# EAGLE design Intsy_128ch_20190417 (EAGLE 9.4.0)
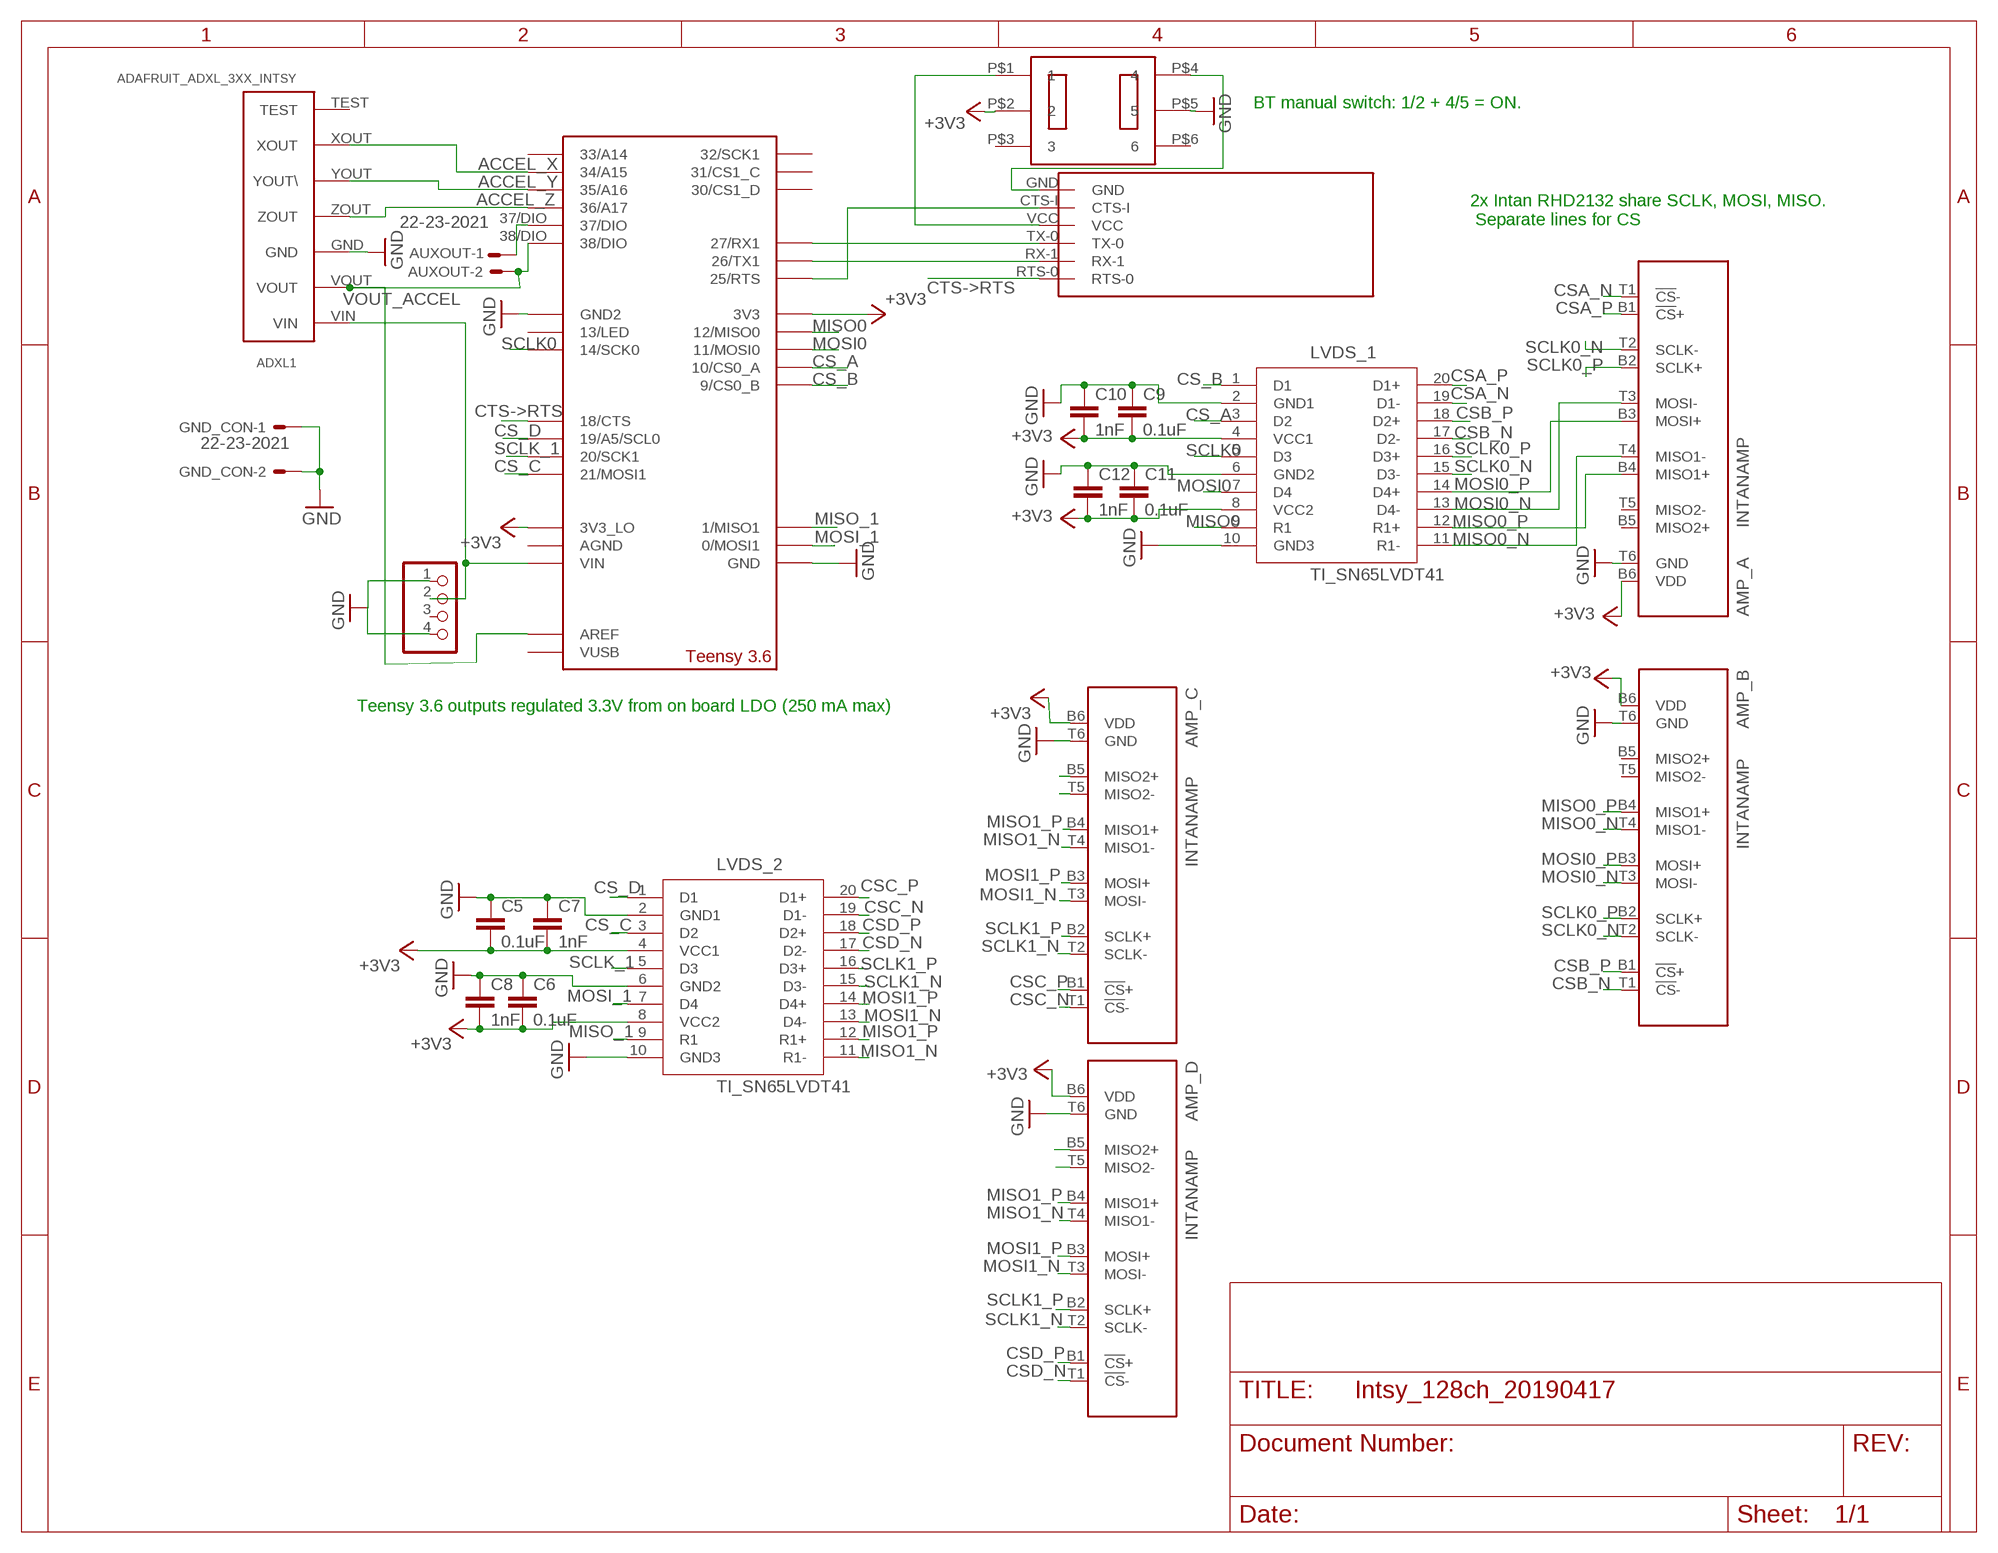
[diagram p0: schematic, sheet 1]

## Parts
ADXL1  ADAFRUIT_ADXL_3XX_INTSY  [ADAFRUIT_ADXL_3XX]
AMP_A  INTANAMP  [AMPBOARD]
AMP_B  INTANAMP  [AMPBOARD]
AMP_C  INTANAMP  [AMPBOARD]
AMP_D  INTANAMP  [AMPBOARD]
AUXOUT  22-23-2021  [22-23-2021]
C5  0.1uF  CC2012  [C2012]
C6  0.1uF  CC2012  [C2012]
C7  1nF  CC2012  [C2012]
C8  1nF  CC2012  [C2012]
C9  0.1uF  CC2012  [C2012]
C10  1nF  CC2012  [C2012]
C11  0.1uF  CC2012  [C2012]
C12  1nF  CC2012  [C2012]
DPDT_1  DPDT_1  SLIDE_SWITCH_DPDT_NIDEC  [SLIDE_SWITCH_DPDT_NIDEC]
GND_CON  22-23-2021  [22-23-2021]
LVDS_1  TI_SN65LVDT41  [SN65LVDT41_TSSOP20]
LVDS_2  TI_SN65LVDT41  [SN65LVDT41_TSSOP20]
RN42  RN42  [RN42]
SW1  LiPoIn  PADS-4  [PADS-4]
U$2  TEENSY_3.5/3.6_SIMPLE  [TEENSY_3.5/3.6_SIMPLE]

## Nets
+3V3: AMP_A.B6(VDD) AMP_B.B6(VDD) AMP_C.B6(VDD) AMP_D.B6(VDD) C5.2 C6.2 C7.2 C8.2 C9.2 C10.2 C11.2 C12.2 DPDT_1.P$2 LVDS_1.4(VCC1) LVDS_1.8(VCC2) LVDS_2.4(VCC1) LVDS_2.8(VCC2) U$2.3V3 U$2.3V3_LO
ACCEL_X: ADXL1.XOUT U$2.34/A15
ACCEL_Y: ADXL1.YOUT(YOUT\) U$2.35/A16
ACCEL_Z: ADXL1.ZOUT U$2.36/A17
CS_A: LVDS_1.3(D2) U$2.10/CS(10/CS0_A)
CS_B: LVDS_1.1(D1) U$2.9/CS(9/CS0_B)
CS_C: LVDS_2.3(D2) U$2.21/CS0/MOSI1(21/MOSI1)
CS_D: LVDS_2.1(D1) U$2.19/A5/SCL(19/A5/SCL0)
CSA_N: AMP_A.T1(!CS!-) LVDS_1.19(D1-)
CSA_P: AMP_A.B1(!CS!+) LVDS_1.20(D1+)
CSB_N: AMP_B.T1(!CS!-) LVDS_1.17(D2-)
CSB_P: AMP_B.B1(!CS!+) LVDS_1.18(D2+)
CSC_N: AMP_C.T1(!CS!-) LVDS_2.19(D1-)
CSC_P: AMP_C.B1(!CS!+) LVDS_2.20(D1+)
CSD_N: AMP_D.T1(!CS!-) LVDS_2.17(D2-)
CSD_P: AMP_D.B1(!CS!+) LVDS_2.18(D2+)
CTS->RTS: RN42.RTS-0 U$2.18/CTS
GND: ADXL1.GND AMP_A.T6(GND) AMP_B.T6(GND) AMP_C.T6(GND) AMP_D.T6(GND) C5.1 C6.1 C7.1 C8.1 C9.1 C10.1 C11.1 C12.1 DPDT_1.P$5 GND_CON.1 GND_CON.2 LVDS_1.2(GND1) LVDS_1.6(GND2) LVDS_1.10(GND3) LVDS_2.2(GND1) LVDS_2.6(GND2) LVDS_2.10(GND3) SW1.1 SW1.4 U$2.GND U$2.GND2
MISO0: LVDS_1.9(R1) U$2.12/MISO0
MISO0_N: AMP_A.T4(MISO1-) AMP_B.T4(MISO1-) LVDS_1.11(R1-)
MISO0_P: AMP_A.B4(MISO1+) AMP_B.B4(MISO1+) LVDS_1.12(R1+)
MISO1_N: AMP_C.T4(MISO1-) AMP_D.T4(MISO1-) LVDS_2.11(R1-)
MISO1_P: AMP_C.B4(MISO1+) AMP_D.B4(MISO1+) LVDS_2.12(R1+)
MISO_1: LVDS_2.9(R1) U$2.1/MISO1
MOSI0: LVDS_1.7(D4) U$2.11/MOSI0
MOSI0_N: AMP_A.T3(MOSI-) AMP_B.T3(MOSI-) LVDS_1.13(D4-)
MOSI0_P: AMP_A.B3(MOSI+) AMP_B.B3(MOSI+) LVDS_1.14(D4+)
MOSI1_N: AMP_C.T3(MOSI-) AMP_D.T3(MOSI-) LVDS_2.13(D4-)
MOSI1_P: AMP_C.B3(MOSI+) AMP_D.B3(MOSI+) LVDS_2.14(D4+)
MOSI_1: LVDS_2.7(D4) U$2.0/MOSI1
N$1: ADXL1.VIN SW1.2 U$2.VIN
N$2: AMP_C.B5(MISO2+)
N$3: AUXOUT.1 U$2.37/DIO
N$4: DPDT_1.P$4 RN42.GND
N$5: RN42.TX-0 U$2.27/RX1
N$6: RN42.RX-1 U$2.26/TX1
N$7: RN42.CTS-I U$2.25/RTS
N$8: AMP_C.T5(MISO2-)
N$9: DPDT_1.P$1 RN42.VCC
N$17: AMP_D.B5(MISO2+)
N$18: AMP_D.T5(MISO2-)
SCLK0: LVDS_1.5(D3) U$2.14/SCK0
SCLK0_N: AMP_A.T2(SCLK-) AMP_B.T2(SCLK-) LVDS_1.15(D3-)
SCLK0_P: AMP_A.B2(SCLK+) AMP_B.B2(SCLK+) LVDS_1.16(D3+)
SCLK1_N: AMP_C.T2(SCLK-) AMP_D.T2(SCLK-) LVDS_2.15(D3-)
SCLK1_P: AMP_C.B2(SCLK+) AMP_D.B2(SCLK+) LVDS_2.16(D3+)
SCLK_1: LVDS_2.5(D3) U$2.20/CS0/SCK1(20/SCK1)
VOUT_ACCEL: ADXL1.VOUT AUXOUT.2 U$2.38/DIO U$2.AREF
Unconnected: ADXL1.TEST AMP_A.B5(MISO2+) AMP_A.T5(MISO2-) AMP_B.B5(MISO2+) AMP_B.T5(MISO2-) DPDT_1.P$3 DPDT_1.P$6 SW1.3 U$2.13/LED/SCK0(13/LED) U$2.30/CS1(30/CS1_D) U$2.31/CS1(31/CS1_C) U$2.32/SCK1 U$2.33/A14 U$2.AGND U$2.VUSB

## Notes on the sheet
- BT manual switch: 1/2 + 4/5 = ON.
- 2x Intan RHD2132 share SCLK, MOSI, MISO.
   Separate lines for CS
- Teensy 3.6 outputs regulated 3.3V from on board LDO (250 mA max)

## Library data of the parts
ADXL1 = adafruit_ADXL3xx_Intsy:ADAFRUIT_ADXL_3XX_INTSY: Bare bones 0.1" header row connector to plug in adafruit ADXL3xx module into a larger system (Intsy), for example, product 1018: https://www.adafruit.com/product/1018
AMP_A AMP_B AMP_C AMP_D = INTANAMP:INTANAMP
AUXOUT GND_CON = con-molex:22-23-2021: .100" (2.54mm) Center Header - 2 Pin; MF: MOLEX; MPN: 22-23-2021; OC_FARNELL: 1462926; OC_NEWARK: 25C3832
C5-C12 = eagle-ltspice:C: CAPACITOR, European symbol; SPICEMODEL: NONE; SPICEPREFIX: C
DPDT_1 = Teensy356:SLIDE_SWITCH_DPDT_NIDEC
LVDS_1 LVDS_2 = TI_SN65LVDT41:TI_SN65LVDT41: TI SN65LVDT41 LVDS-CMOS converter with 4 drivers + 1 receiver. Based on datasheet: http://www.ti.com/lit/ds/symlink/sn65lvdt14-ep.pdf
RN42 = BLUETOOTH_MODULES:RN42
SW1 = breakouts:PADS-4: PIN HEADER
U$2 = Teensy356:TEENSY_3.5/3.6_SIMPLE: Teensy 3.6 for Intsy 128 chan module (SPI0 and SPI1) + Bluetooth Coms (RX/TX + CTS/RTS) + Analog accelerometer (ax, ay, az) + digital I/O + power. Only pins used in the module are retained in this device; the rest are removed to allow for easier/uncluttered wiring. -Jon Erickson, 07 May 2019

## Board
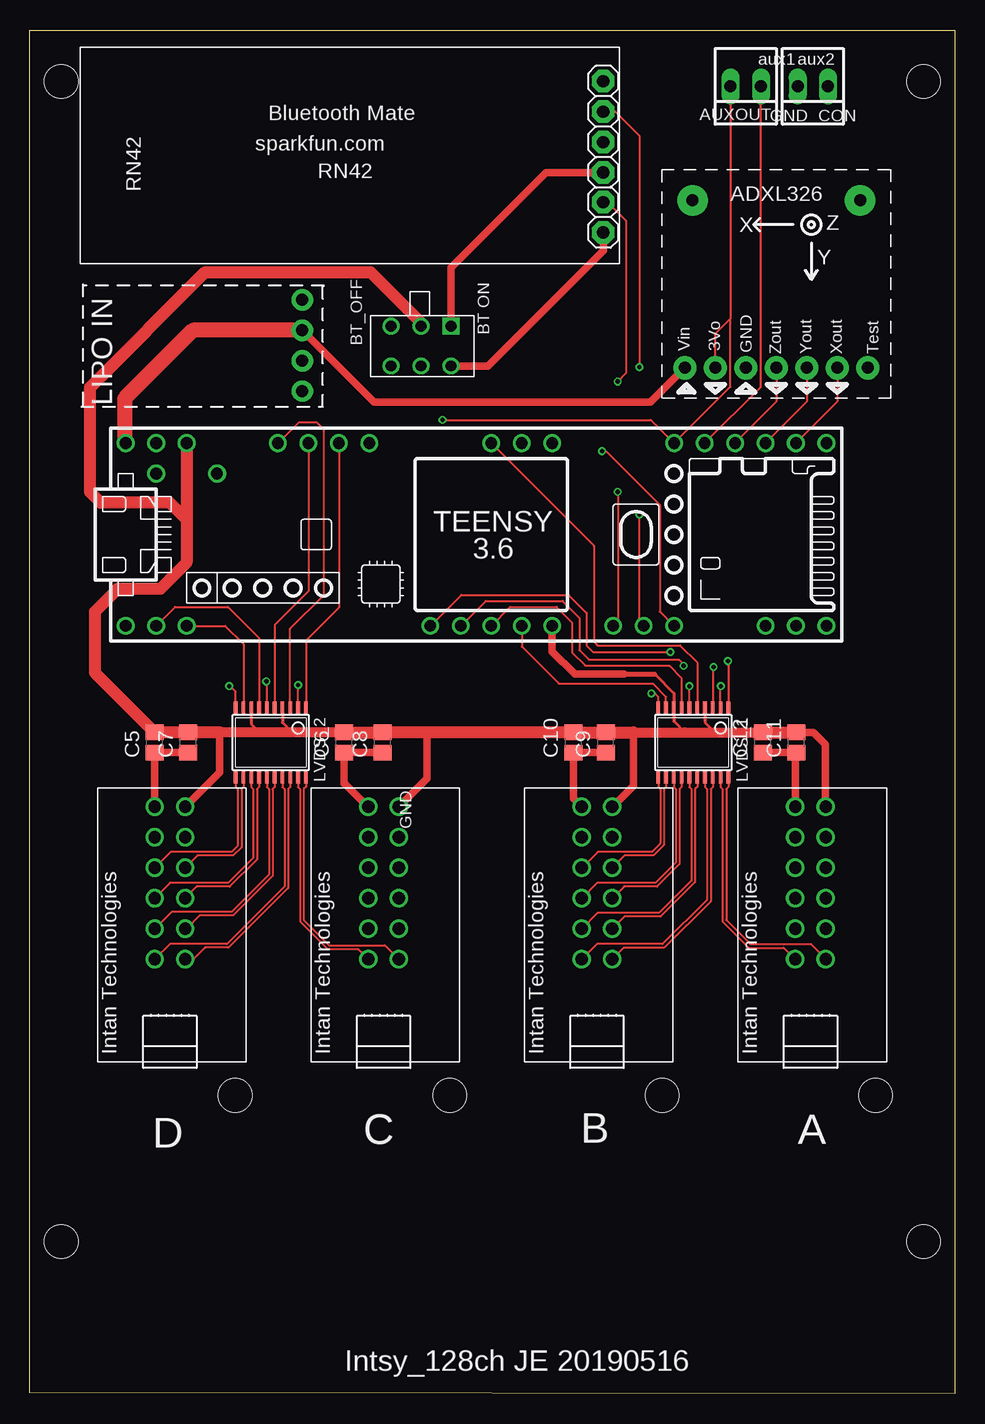
[diagram p1: board, top side]
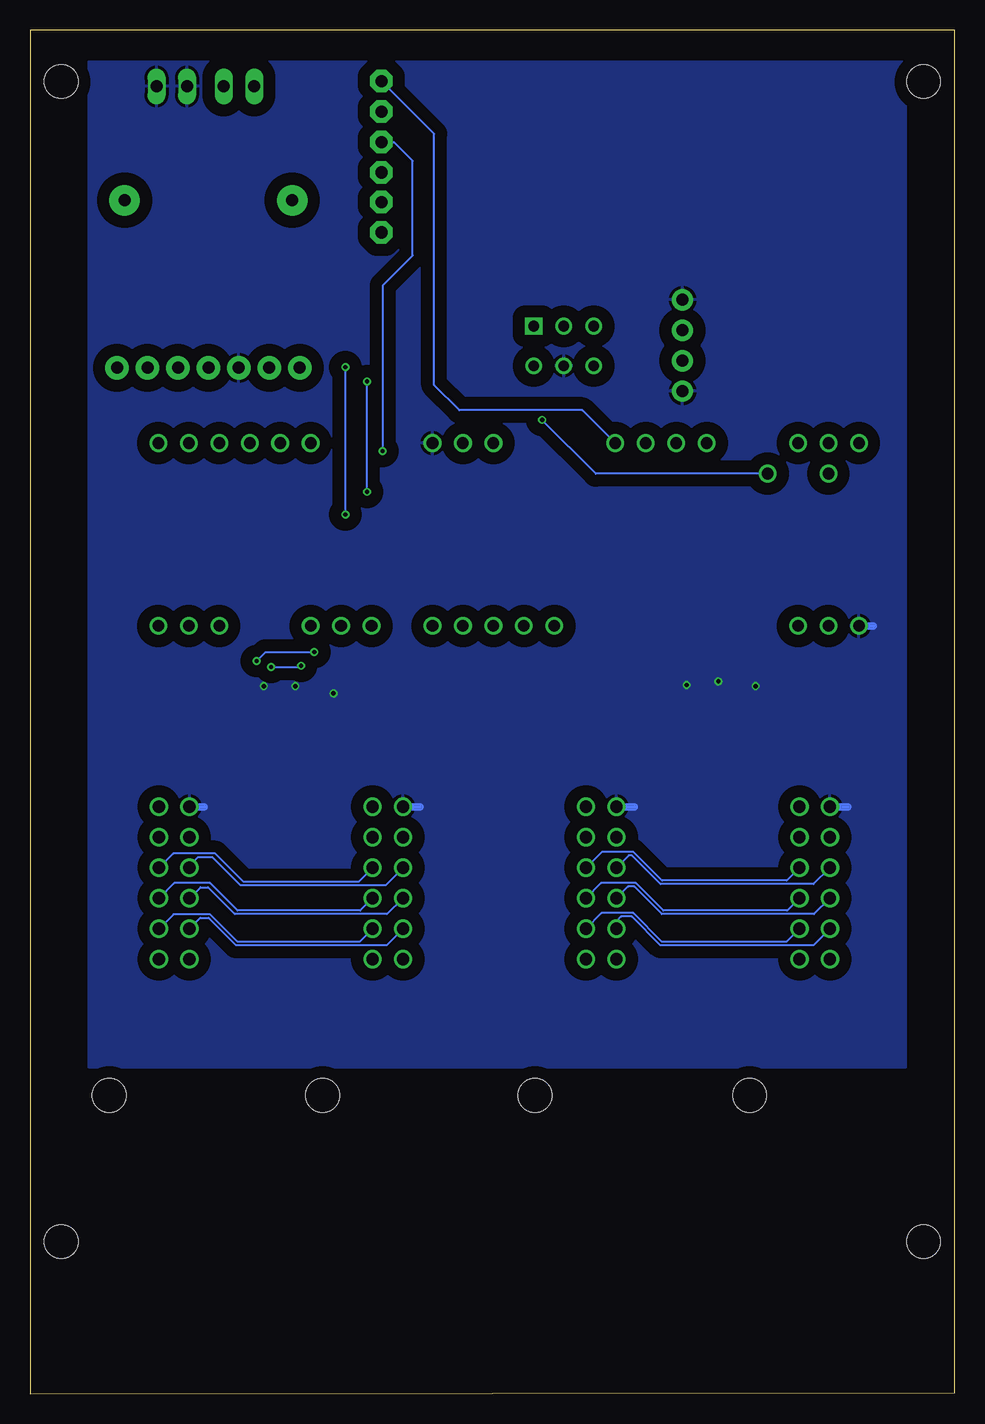
[diagram p2: board, bottom side, seen from below]

Size 77.1 x 113.69 mm. Coordinates in mm from the lower left corner, seen from the top.
Outline: 0,0.1 0,113.69 77.1,113.69 77.1,0 0,0.1
Copper layers (1*16): Top 0.035mm / dielectric 1.5mm / Bottom 0.035mm
Design rules "SeeedStudio_2layer_DRU_no_angle_20140221": minimum track width 6mil, minimum drill 12mil, track to track 6mil, track to pad 6mil, pad to pad 6mil, via to via 6mil, smd to smd 0mil, copper to edge 10mil, drill to drill 10mil, minimum pad ring 10mil, minimum via ring 6mil, stop-mask expansion 2mil, vias tented up to drill 100mil, thermal gap 10mil
Holes 2.8 mm at 35,24.89 17.1,24.89 2.6,109.39 2.6,12.69 74.5,12.69 74.5,109.39 52.7,24.89 70.5,24.89
tKeepout: area 0.7,107.3 to 4.5,111.2; area 72.6,107.4 to 76.4,111.3; area 0.7,10.6 to 4.5,14.5; area 72.6,10.7 to 76.4,14.6

### Footprints (pad centres in the part's own frame; a part is rotated, then mirrored left to right if it is on the bottom)
ADAFRUIT_ADXL_3XX = drill 1 pad 1.93: GND 6.985,2.54; TEST 17.145,2.54; VIN 1.905,2.54; VOUT 4.445,2.54; XOUT 14.605,2.54; YOUT 12.065,2.54; ZOUT 9.525,2.54 | drill 1 pad 2.54: P$1 2.54,16.51; P$2 16.51,16.51
AMPBOARD = drill 1.016: B1 -2.857,-2.857; B2 -2.857,-0.318; B3 -2.857,2.223; B4 -2.857,4.763; B5 -2.857,7.303; B6 -2.857,9.842; T1 -5.397,-2.857; T2 -5.397,-0.318; T3 -5.397,2.223; T4 -5.397,4.763; T5 -5.397,7.303; T6 -5.397,9.842
22-23-2021 = drill 1 long: 1 -1.27,0; 2 1.27,0
C2012 = smd 1.3 x 1.5: 1 -0.85,0; 2 0.85,0
SLIDE_SWITCH_DPDT_NIDEC = drill 0.9 pad 1.422 square: P$1 -1.7,2.4 | drill 0.9 pad 1.27: P$2 -1.7,-0.1; P$3 -1.7,-2.6; P$4 1.6,2.4; P$5 1.6,-0.1; P$6 1.6,-2.6
SN65LVDT41_TSSOP20 = smd 0.305 x 0.991: 1 -2.925,-2.918; 2 -2.275,-2.918; 3 -1.625,-2.918; 4 -0.975,-2.918; 5 -0.325,-2.918; 6 0.325,-2.918; 7 0.975,-2.918; 8 1.625,-2.918; 9 2.275,-2.918; 10 2.925,-2.918; 11 2.925,2.918; 12 2.275,2.918; 13 1.625,2.918; 14 0.975,2.918; 15 0.325,2.918; 16 -0.325,2.918; 17 -0.975,2.918; 18 -1.625,2.918; 19 -2.275,2.918; 20 -2.925,2.918
RN42 = drill 1.016 pad 1.88 octagon: CTS-I -7.822,-23.538; GND -10.362,-23.538; RTS-0 2.258,-23.538; RX-1 -0.282,-23.538; TX-0 -2.822,-23.538; VCC -5.362,-23.538
PADS-4 = drill 1.016 pad 1.778: 1 -3.81,0; 2 -1.27,0; 3 1.27,0; 4 3.81,0
TEENSY_3.5/3.6_SIMPLE = drill 0.965: 0/MOSI1 -5.08,17.78; 1/MISO1 -5.08,15.24; 3V3 -5.08,-15.24; 3V3_LO 10.16,15.24; 9/CS -5.08,-5.08; 10/CS -5.08,-7.62; 11/MOSI0 -5.08,-10.16; 12/MISO0 -5.08,-12.7; 13/LED/SCK0 10.16,-12.7; 14/SCK0 10.16,-10.16; 18/CTS 10.16,0; 19/A5/SCL 10.16,2.54; 20/CS0/SCK1 10.16,5.08; 21/CS0/MOSI1 10.16,7.62; 25/RTS -5.08,-20.32; 26/TX1 -5.08,-22.86; 27/RX1 -5.08,-25.4; 30/CS1 -5.08,-33.02; 31/CS1 -5.08,-35.56; 32/SCK1 -5.08,-38.1; 33/A14 10.16,-38.1; 34/A15 10.16,-35.56; 35/A16 10.16,-33.02; 36/A17 10.16,-30.48; 37/DIO 10.16,-27.94; 38/DIO 10.16,-25.4; AGND 10.16,17.78; AREF 7.62,12.7; GND -5.08,20.32; GND2 10.16,-15.24; VIN 10.16,20.32; VUSB 7.62,17.78

### Placement (x,y rotation side)
ADXL1  52.7,82.99 0 top
AMP_A  69.2,39.09 0 top
AMP_B  51.4,39.09 0 top
AMP_C  33.6,39.09 0 top
AMP_D  15.8,39.09 0 top
AUXOUT  59.67,108.99 180 top
C5  10.4,54.29 90 top
C6  26.2,54.29 90 top
C7  13.2,54.29 90 top
C8  29.4,54.29 90 top
C9  48,54.29 90 top
C10  45.3,54.29 90 top
C11  63.9,54.29 90 top
C12  61.1,54.29 90 top
DPDT_1  32.7,87.29 270 top
GND_CON  65.27,108.99 180 top
LVDS_1  55.3,54.29 180 top
LVDS_2  20.08,54.29 180 top
RN42  24.26,107.17 90 top
SW1  22.7,87.39 270 bottom
U$2  28.3,69.09 90 top

### Tracks (layer width: path | path; a pad name or v marks a point on that pad's centre or on a via)
+3V3
  Top 0.254: 52.1,59.99 53.7,58.39 53.7,57.23 LVDS_1.8 53.68,56.06 54.6,55.14 | LVDS_2.8 18.45,55.84 19.15,55.14 | LVDS_2.4 21.05,55.94 21.85,55.14 | 57.1,55.14 56.27,55.96 LVDS_1.4
  Top 0.406: 49.5,59.99 52.1,59.99
  Top 0.61: U$2.3V3 43.54,61.89 45.44,59.99 49.5,59.99 | C8.2 29.45,55.19 30.1,55.19 30.15,55.14 | C11.2 65.3,55.14 66.3,54.14 66.3,48.97 AMP_A.B6 | AMP_B.B6 50.3,50.69 50.3,55.14 | 15.8,55.14 15.8,51.79 AMP_D.B6 | 33.1,55.14 33.1,51.29 AMP_C.B6
  Top 0.813: C6.2 21.85,55.14 19.15,55.14 15.8,55.14 | C12.2 57.1,55.14 54.6,55.14 50.3,55.14
  Top 1.016: C6.2 C8.2 | C12.2 C11.2 | 15.8,55.14 C7.2 C5.2 5.4,60.14 5.4,65.19 7.3,67.09 10.86,67.09 13.06,69.29 13.06,72.89 | 50.3,55.14 C9.2 C10.2 33.1,55.14 30.15,55.14 | U$2.3V3_LO 13.06,72.89 | 13.06,72.89 11.66,74.29 5.9,74.29 5,75.19 5,83.89 14.6,93.49 28.4,93.49 32.6,89.29 DPDT_1.P$2
ACCEL_X
  Top 0.152: ADXL1.XOUT 67.3,82.69 U$2.34/A15
ACCEL_Y
  Top 0.152: ADXL1.YOUT 64.77,82.69 U$2.35/A16
ACCEL_Z
  Top 0.152: ADXL1.ZOUT 62.23,82.69 U$2.36/A17
CS_A  (via drill 0.35)
  Top 0.152: U$2.10/CS 38,66.09 44.4,66.09 45.8,64.69 45.8,61.99 46.6,61.19 54.1,61.19 54.5,60.79 v54.5,60.69 | v57,60.59 56.93,60.51 LVDS_1.3
  Bottom 0.152: v54.5,60.69 54.6,60.59 v57,60.59
CS_B  (via drill 0.35)
  Top 0.152: U$2.9/CS 35.96,66.59 44.9,66.59 46.4,65.09 46.4,62.39 46.96,61.83 v53.4,61.83 | v58.2,61.09 58.23,61.06 LVDS_1.1
  Bottom 0.152: v58.2,61.09 57.46,61.83 v53.4,61.83
CS_C
  Top 0.152: U$2.21/CS0/MOSI1 22.42,80.99 23.9,80.99 24.5,80.39 24.5,66.59 21.7,63.79 LVDS_2.3
CS_D
  Top 0.152: U$2.19/A5/SCL 25.76,65.55 23,62.79 LVDS_2.1
CSA_N
  Top 0.152: LVDS_1.19 57.58,50.57 57.75,50.4 57.75,39.36 59.93,37.18 62.85,37.18 AMP_A.T1
CSA_P
  Top 0.152: LVDS_1.20 58.23,50.57 58.05,50.4 58.05,39.49 60.05,37.49 65.08,37.49 AMP_A.B1
CSB_N
  Top 0.152: LVDS_1.17 56.27,50.57 56.45,50.4 56.45,41.19 52.75,37.49 47.26,37.49 AMP_B.T1
CSB_P
  Top 0.152: LVDS_1.18 56.93,50.57 56.75,50.4 56.75,41.06 52.87,37.18 49.5,37.18 AMP_B.B1
CSC_N
  Top 0.152: LVDS_2.19 22.35,50.57 22.52,50.4 22.52,39.36 24.8,37.08 27.35,37.08 AMP_C.T1
CSC_P
  Top 0.152: LVDS_2.20 23,50.57 22.83,50.4 22.83,39.49 24.93,37.39 29.59,37.39 AMP_C.B1
CSD_N
  Top 0.152: LVDS_2.17 21.05,50.57 21.22,50.4 21.22,42.29 16.43,37.5 11.67,37.5 AMP_D.T1
CSD_P
  Top 0.152: LVDS_2.18 21.7,50.57 21.53,50.4 21.53,42.16 20.95,41.59 16.56,37.2 14.62,37.2 13.65,36.23 AMP_D.B1
CTS->RTS
  Bottom 0.152: U$2.18/CTS 31.04,81.99 41.3,81.99 43.4,84.09 43.4,105.03 RN42.RTS-0
GND  (via drill 0.35)
  Top 0.152: v16.6,58.99 16.65,59.04 17.15,58.54 LVDS_2.10 | LVDS_2.6 19.75,59.39 v19.7,59.39 | LVDS_2.2 v22.35,59.09 | LVDS_1.10 52.38,58.09 51.98,58.49 51.9,58.49 v51.8,58.39 | LVDS_1.6 v54.98,58.99 | LVDS_1.2 57.58,58.99 v57.6,58.99
  Top 0.61: C7.1 C5.1 AMP_D.T6 | C8.1 C6.1 26.2,50.89 26.25,50.89 AMP_C.T6 | C9.1 C10.1 45.3,49.63 AMP_B.T6 | C12.1 C11.1 63.8,53.34 AMP_A.T6
  Bottom 0.61: AMP_D.T6 8.9,48.93 | AMP_C.T6 26.7,48.93 | AMP_B.T6 44.6,48.93 | AMP_A.T6 62.6,48.93 | U$2.GND 6.8,64.01
  pour Bottom (isolate 1.016): 72.2,111.09 4.1,111.09 4.1,27.19 72.2,27.19
MISO0
  Top 0.152: LVDS_1.9 53.02,58.09 51.93,59.19 44.1,59.19 41,62.29 U$2.12/MISO0
MISO0_N
  Top 0.152: LVDS_1.11 52.38,50.57 52.55,50.4 52.55,45.89 51.85,45.19 47.34,45.19 AMP_B.T4
  Bottom 0.152: AMP_B.T4 47.47,42.38 59.53,42.38 61.85,44.71 63.14,44.71 63.8,44.04 AMP_A.T4
MISO0_P
  Top 0.152: LVDS_1.12 53.02,50.57 52.85,50.4 52.85,45.76 51.97,44.88 49.58,44.88 AMP_B.B4
  Bottom 0.152: AMP_B.B4 49.7,42.69 59.3,42.69 61.65,45.04 65.15,45.04 AMP_A.B4
MISO1_N
  Top 0.152: LVDS_2.11 17.15,50.57 17.32,50.4 17.32,45.69 16.82,45.19 11.74,45.19 AMP_D.T4
  Bottom 0.152: AMP_D.T4 11.77,42.48 24.53,42.48 26.92,44.88 27.18,44.88 AMP_C.T4
MISO1_P
  Top 0.152: LVDS_2.12 17.8,50.57 17.63,50.4 17.63,45.56 16.95,44.88 13.97,44.88 AMP_D.B4
  Bottom 0.152: AMP_D.B4 14,42.79 24.4,42.79 26.8,45.18 29.41,45.18 AMP_C.B4
MISO_1
  Top 0.152: U$2.1/MISO1 16.28,64.01 17.8,62.49 LVDS_2.9
MOSI0
  Top 0.152: U$2.11/MOSI0 40.04,65.59 43.9,65.59 45.2,64.29 45.2,61.79 46.3,60.69 53.3,60.69 54.33,59.66 LVDS_1.7
MOSI0_N
  Top 0.152: LVDS_1.13 53.68,50.57 53.85,50.4 53.85,44.29 52.15,42.59 47.28,42.59 AMP_B.T3
  Bottom 0.152: AMP_B.T3 47.33,39.98 60.03,39.98 62.27,42.22 62.89,42.22 AMP_A.T3
MOSI0_P
  Top 0.152: LVDS_1.14 54.33,50.57 54.15,50.4 54.15,44.16 52.27,42.28 49.5,42.28 49.5,42.27 AMP_B.B3
  Bottom 0.152: AMP_B.B3 49.57,40.29 59.8,40.29 62.09,42.58 65.08,42.58 AMP_A.B3
MOSI1_N
  Top 0.152: LVDS_2.13 18.45,50.57 18.62,50.4 18.62,44.69 16.52,42.59 11.68,42.59 AMP_D.T3
  Bottom 0.152: AMP_D.T3 11.73,39.98 24.43,39.98 26.72,42.27 27.24,42.27 AMP_C.T3
MOSI1_P
  Top 0.152: LVDS_2.14 19.1,50.57 18.93,50.4 18.93,44.56 16.65,42.28 13.91,42.28 AMP_D.B3
  Bottom 0.152: AMP_D.B3 13.96,40.29 24.3,40.29 26.59,42.58 29.48,42.58 AMP_C.B3
MOSI_1
  Top 0.152: U$2.0/MOSI1 12.1,65.59 16.5,65.59 19.1,62.99 LVDS_2.7
N$1
  Top 0.61: ADXL1.VIN 51.73,82.66 28.7,82.66 SW1.2
  Top 1.27: U$2.VIN 7.9,79.33 7.9,82.99 13.57,88.66 SW1.2
N$3
  Top 0.152: U$2.37/DIO 60.88,83.89 60.9,83.89 60.9,108.95 AUXOUT.1
N$4
  Top 0.61: DPDT_1.P$4 38.2,85.69 47.8,95.29 RN42.GND
N$5  (via drill 0.35)
  Top 0.152: U$2.27/RX1 52.5,65.21 52.5,74.09 48,78.59 v47.7,78.59
  Bottom 0.152: RN42.TX-0 46.76,104.35 45.2,102.79 45.2,94.89 47.7,92.39 v47.7,78.59
N$6  (via drill 0.35)
  Top 0.152: U$2.26/TX1 50.8,64.37 v50.8,73.29 | RN42.RX-1 48.8,106.89 50.8,104.89 v50.8,85.59
  Bottom 0.152: v50.8,73.29 v50.8,85.59
N$7  (via drill 0.35)
  Top 0.152: U$2.25/RTS 49.02,64.41 49.02,75.17 v49,75.19 | RN42.CTS-I 48.14,99.35 49.7,97.79 49.7,85.09 v49,84.39
  Bottom 0.152: v49,75.19 v49,84.39
N$9
  Top 0.61: RN42.VCC 43.02,101.81 35.1,93.89 DPDT_1.P$1
SCLK0
  Top 0.152: U$2.14/SCK0 47,70.71 47,62.69 47.3,62.39 54.2,62.39 55.62,60.96 LVDS_1.5
SCLK0_N
  Top 0.152: LVDS_1.15 54.98,50.57 55.15,50.4 55.15,42.79 52.45,40.09 47.32,40.09 AMP_B.T2
  Bottom 0.152: AMP_B.T2 47.39,37.38 59.93,37.38 62.22,39.67 62.9,39.67 AMP_A.T2
SCLK0_P
  Top 0.152: LVDS_1.16 55.62,50.57 55.45,50.4 55.45,42.66 52.57,39.78 49.55,39.78 AMP_B.B2
  Bottom 0.152: AMP_B.B2 49.62,37.69 59.8,37.69 62.09,39.98 65.14,39.98 AMP_A.B2
SCLK1_N
  Top 0.152: LVDS_2.15 19.75,50.57 19.92,50.4 19.92,43.29 16.82,40.19 15.32,40.19 15.32,40.18 11.82,40.18 AMP_D.T2
  Bottom 0.152: AMP_D.T2 11.79,37.38 24.53,37.38 26.92,39.77 27.82,39.77 28.2,39.39 AMP_C.T2
SCLK1_P
  Top 0.152: LVDS_2.16 20.4,50.57 20.23,50.4 20.23,43.16 16.95,39.88 15.9,39.88 14.16,39.88 13.05,38.77 AMP_D.B2
  Bottom 0.152: AMP_D.B2 14.03,37.69 24.4,37.69 26.79,40.08 29.44,40.08 AMP_C.B2
SCLK_1
  Top 0.152: U$2.20/CS0/SCK1 23.22,66.91 20.4,64.09 LVDS_2.5
VOUT_ACCEL  (via drill 0.35)
  Top 0.152: v34.4,81.19 51.76,81.19 U$2.38/DIO 58.4,83.95 58.4,89.29 58.4,89.64 | ADXL1.VOUT 57.15,88.39 58.4,89.64 | AUXOUT.2 58.4,89.64
  Bottom 0.152: v34.4,81.19 29.92,76.71 U$2.AREF

### Text on the board
tPlace: aux1 | aux2 | LIPO IN | BT ON | BT_OFF | GND | C | B | A | D | Intsy_128ch JE 20190516